# Altium schematic sheet NB3000_FAT_File_System.SchDoc
size A
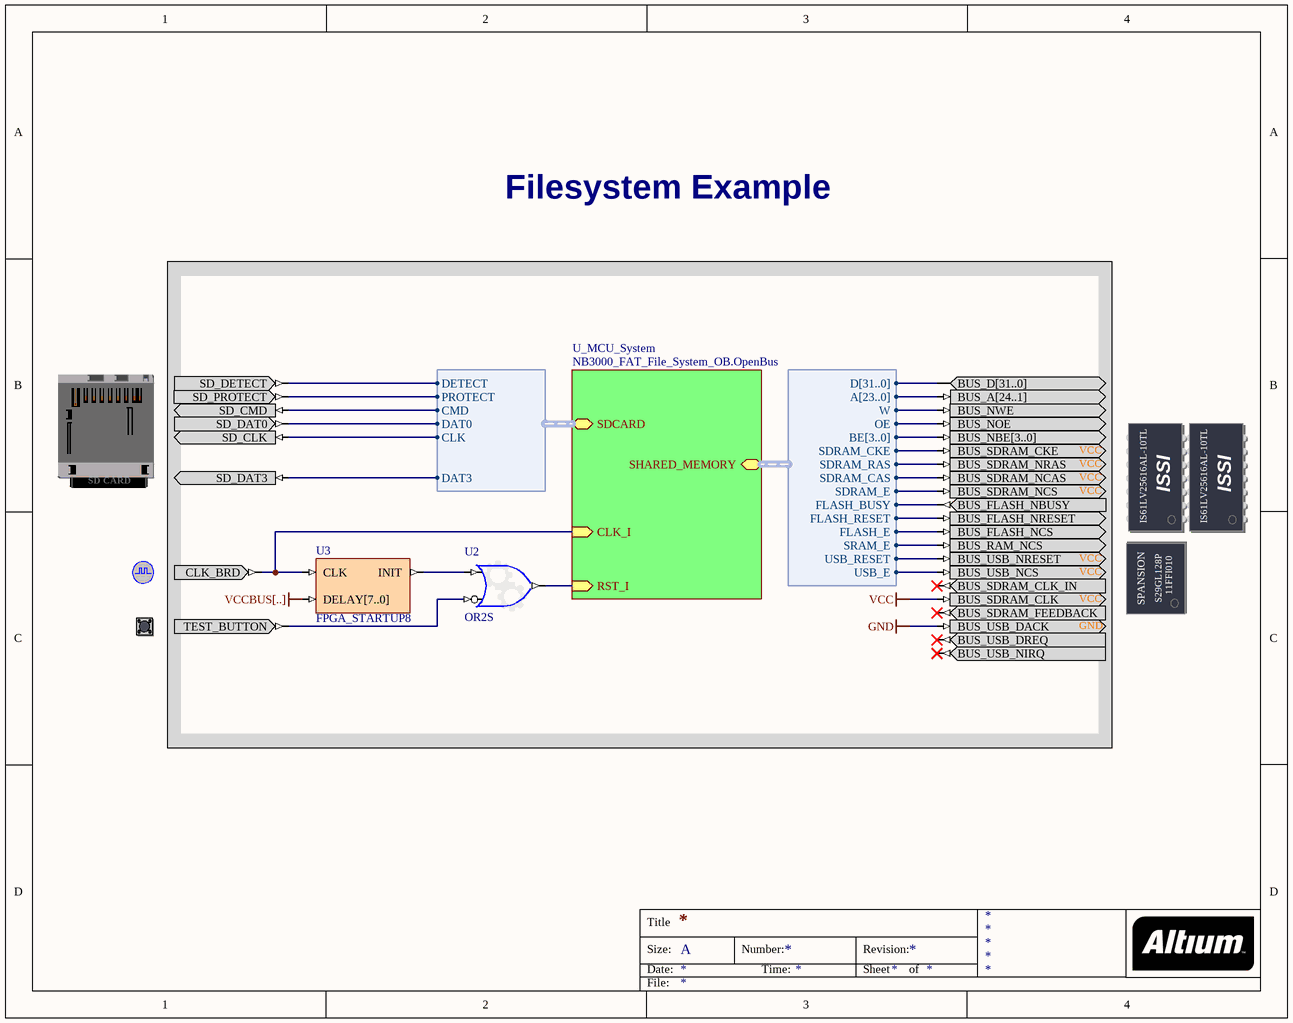
[diagram p0: NB3000_FAT_File_System.SchDoc]

## Parts
(Parts that share a designator on the sheet are numbered #1, #2 ... from top to bottom, then left to right.)
?#1  SHARED_SRAM_FLASH  (value not drawn)
?#2  CLOCK_BOARD  (value not drawn)
?#3  TEST_BUTTON  (value not drawn)
SDCARD_READER  SD_CARD  (value not drawn)
U2  OR2S
U3  FPGA_STARTUP8

## Sub-sheets
U_MCU_System = NB3000_FAT_File_System_OB.OpenBus: RST_I (in), CLK_I (in), SHARED_MEMORY (harness WB_SHARED_MEM_CTRL), SDCARD (harness WB_SDCARD)

## Harnesses
WB_SHARED_MEM_CTRL: D[31..0], A[23..0], W, OE, BE[3..0], SDRAM_CKE, SDRAM_RAS, SDRAM_CAS, SDRAM_E, FLASH_BUSY, FLASH_RESET, FLASH_E, SRAM_E, USB_RESET, USB_E
WB_SDCARD: DETECT, PROTECT, CMD, DAT0, CLK, DAT3

## Nets
GND: ?#1.BUS_USB_DACK
VCC: ?#1.BUS_SDRAM_CLK
VCCBUS[..]: U3.DELAY[7..0]
Net?#1_BUS_A[24..1]: ?#1.BUS_A[24..1] ; sheet U_MCU_System/SHARED_MEMORY.A[23..0]
Net?#1_BUS_D[31..0]: ?#1.BUS_D[31..0] ; sheet U_MCU_System/SHARED_MEMORY.D[31..0]
Net?#1_BUS_FLASH_NBUSY: ?#1.BUS_FLASH_NBUSY ; sheet U_MCU_System/SHARED_MEMORY.FLASH_BUSY
Net?#1_BUS_FLASH_NCS: ?#1.BUS_FLASH_NCS ; sheet U_MCU_System/SHARED_MEMORY.FLASH_E
Net?#1_BUS_FLASH_NRESET: ?#1.BUS_FLASH_NRESET ; sheet U_MCU_System/SHARED_MEMORY.FLASH_RESET
Net?#1_BUS_NBE[3..0]: ?#1.BUS_NBE[3..0] ; sheet U_MCU_System/SHARED_MEMORY.BE[3..0]
Net?#1_BUS_NOE: ?#1.BUS_NOE ; sheet U_MCU_System/SHARED_MEMORY.OE
Net?#1_BUS_NWE: ?#1.BUS_NWE ; sheet U_MCU_System/SHARED_MEMORY.W
Net?#1_BUS_RAM_NCS: ?#1.BUS_RAM_NCS ; sheet U_MCU_System/SHARED_MEMORY.SRAM_E
Net?#1_BUS_SDRAM_CKE: ?#1.BUS_SDRAM_CKE ; sheet U_MCU_System/SHARED_MEMORY.SDRAM_CKE
Net?#1_BUS_SDRAM_NCAS: ?#1.BUS_SDRAM_NCAS ; sheet U_MCU_System/SHARED_MEMORY.SDRAM_CAS
Net?#1_BUS_SDRAM_NCS: ?#1.BUS_SDRAM_NCS ; sheet U_MCU_System/SHARED_MEMORY.SDRAM_E
Net?#1_BUS_SDRAM_NRAS: ?#1.BUS_SDRAM_NRAS ; sheet U_MCU_System/SHARED_MEMORY.SDRAM_RAS
Net?#1_BUS_USB_NCS: ?#1.BUS_USB_NCS ; sheet U_MCU_System/SHARED_MEMORY.USB_E
Net?#1_BUS_USB_NRESET: ?#1.BUS_USB_NRESET ; sheet U_MCU_System/SHARED_MEMORY.USB_RESET
Net?#2_CLK_BRD: ?#2.CLK_BRD U3.CLK ; sheet U_MCU_System/CLK_I
Net?#3_TEST_BUTTON: ?#3.TEST_BUTTON U2.I1
NetSDCARD_READER_SD_CLK: SDCARD_READER.SD_CLK ; sheet U_MCU_System/SDCARD.CLK
NetSDCARD_READER_SD_CMD: SDCARD_READER.SD_CMD ; sheet U_MCU_System/SDCARD.CMD
NetSDCARD_READER_SD_DAT0: SDCARD_READER.SD_DAT0 ; sheet U_MCU_System/SDCARD.DAT0
NetSDCARD_READER_SD_DAT3: SDCARD_READER.SD_DAT3 ; sheet U_MCU_System/SDCARD.DAT3
NetSDCARD_READER_SD_DETECT: SDCARD_READER.SD_DETECT ; sheet U_MCU_System/SDCARD.DETECT
NetSDCARD_READER_SD_PROTECT: SDCARD_READER.SD_PROTECT ; sheet U_MCU_System/SDCARD.PROTECT
NetU2_I0: U2.I0 U3.INIT
NetU2_O: U2.O ; sheet U_MCU_System/RST_I

Not connected (* = marked no-connect by the designer): ?#1 BUS_SDRAM_CLK_IN* BUS_SDRAM_FEEDBACK* BUS_USB_DREQ* BUS_USB_NIRQ*

## Notes on the sheet
- Filesystem Example
- Title
- Size:
- Date:
- A
- Number:
- Time:
- Revision:
- Sheet
- of
- File:
- (in symbol SD_CARD) SD CARD
- (in symbol SHARED_SRAM_FLASH) VCC; ISSI; IS61LV25616AL-10TL; 11FFI010; SPANSION; S29GL128P; GND

## Library data of the parts
?#1 = SHARED_SRAM_FLASH: Common-Bus SRAM Flash; PortComponent: True; Published: 14-May-2007; Publisher: Altium Limited; HelpURL: https://wiki.altium.com/display/ADOH/Accessing+Common-Bus+Resources+on+the+NanoBoard+3000
?#2 = CLOCK_BOARD: Global System Clock Supply; PortComponent: True; Published: 19-Nov-2003; Publisher: Altium Limited; HelpURL: TR0143 Technical Reference Manual for Altium's Desktop NanoBoard NB2DSK01.pdf#page=41; UseInDSF: True
?#3 = TEST_BUTTON: Test / Reset Button; PortComponent: True; Published: 19-Nov-2003; Publisher: Altium Limited; HelpURL: TR0143 Technical Reference Manual for Altium's Desktop NanoBoard NB2DSK01.pdf#page=53
SDCARD_READER = SD_CARD: Secure Digital Card Socket; PortComponent: True; Published: 22-Jan-2007; Publisher: Altium Limited; UseInDSF: True; HelpURL: https://wiki.altium.com/display/ADOH/NanoBoard+3000+-+SD+Card+Reader+%28User+FPGA%29
U2 = GATE: Configurable Generic Gate; ConfiguratorName: GENERIC_GATE; ConfigurationParameters: {}Version[1.0]{}GateKind[OR]{}BusInput[False]{}GateInputType[Bit]{}GateOutputOption[Normal]{}BusWidth[8]{}RegisterOutputs[False]{}NegativeClockEdge[False]{}InputCount[2]{}InputInvert0[False]{}InputInvert1[True]{}; LastRevisionNo: 1.00.00; Published: 3-Sep-2008; Publisher: Altium Limited
U3 = FPGA_STARTUP8: FPGA Startup With 8 Bit Delay; Published: 9-Dec-2004; Publisher: Altium Limited; HelpURL: CR0119 FPGA_STARTUPx Powerup Delay Unit.pdf; LastRevisionNo: 1.00.00; ComponentLink1Description: Core &Resource Usage; ComponentLink1URL: CR0139 FPGA Peripheral Resource Usage.pdf#page=11